# EAGLE design Grove - NunChuck v1.0 (EAGLE 6.3)
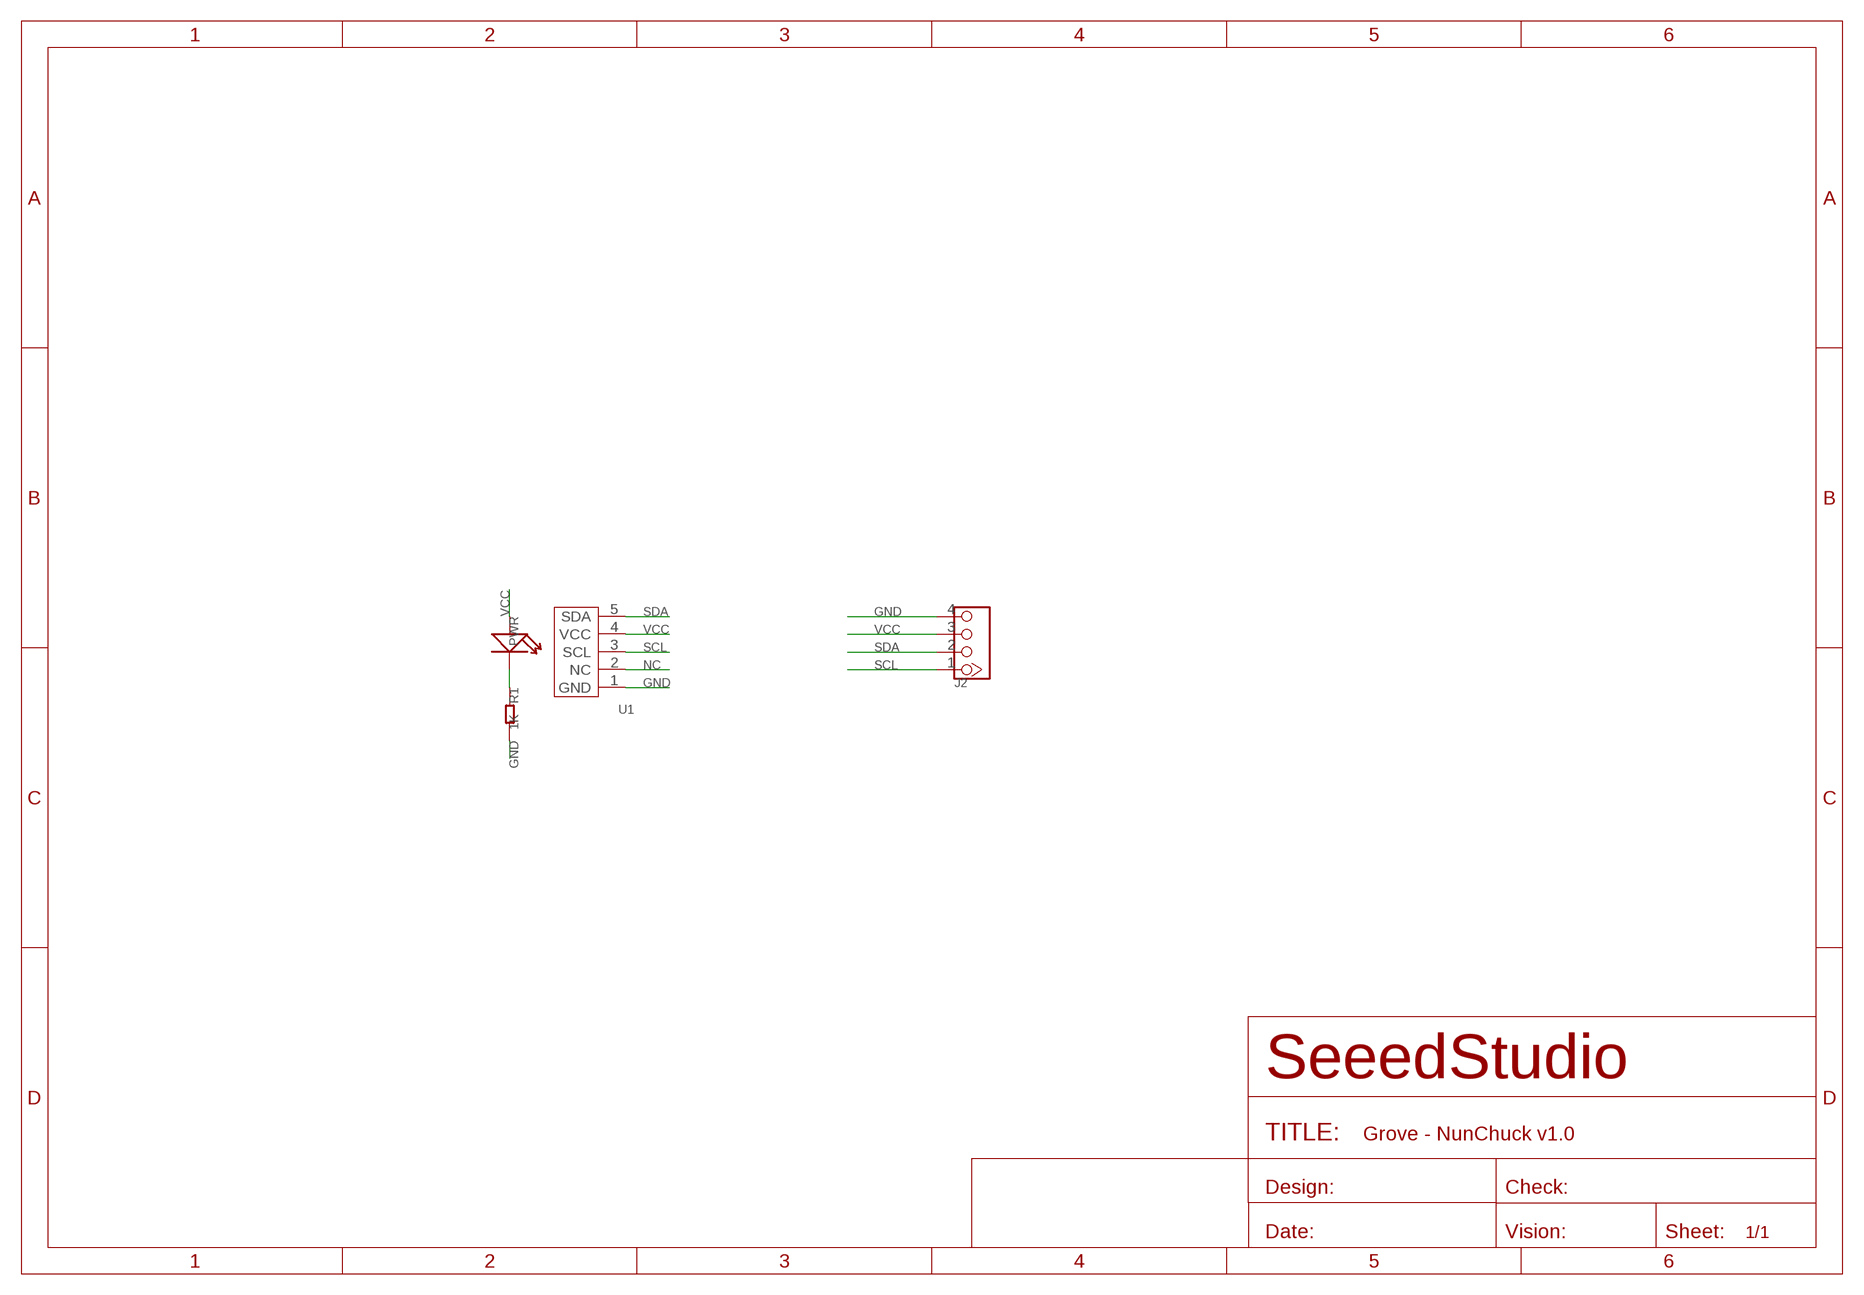
[diagram p0: schematic, sheet 1]

## Parts
J2  TWIG-4P-2.0-2.0  [4P-2.0]
PWR  LED'0603'  [LED-0603]
R1  1K  R-0603  [R0603]
U1  WIICHUCK  [WIICHUCK]

## Nets
GND: J2.4 R1.2 U1.1(GND)
N$1: PWR.- R1.1
NC: U1.2(NC)
SCL: J2.1 U1.3(SCL)
SDA: J2.2 U1.5(SDA)
VCC: J2.3 PWR.+ U1.4(VCC)

## Library data of the parts
J2 = Connector:TWIG-4P-2.0
PWR = Discrete:LED*
R1 = Discrete:R*
U1 = template:WIICHUCK

## Net classes
0 default: width 0.203 mm, drill 0.305 mm, clearance 0.152 mm

## Board
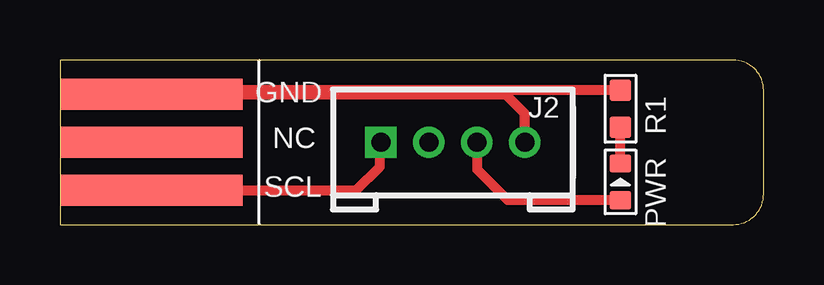
[diagram p1: board, top side]
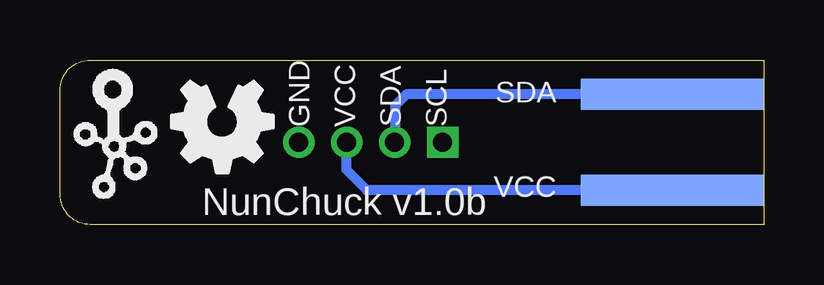
[diagram p2: board, bottom side, seen from below]

Size 29.34 x 6.86 mm. Coordinates in mm from the lower left corner, seen from the top.
Outline: 0,6.86 0,0 28.07,0 arc90 29.34,1.27 29.34,5.59 arc90 28.07,6.86 0,6.86
Copper layers (1*16): Top 0.035mm / dielectric 1.5mm / Bottom 0.035mm
Design rules "SeeedStudio_rule_no_angle_090911 *": minimum track width 6mil, minimum drill 12mil, track to track 6mil, track to pad 6mil, pad to pad 6mil, via to via 6mil, smd to smd 0mil, copper to edge 10mil, drill to drill 10mil, minimum pad ring 10mil, minimum via ring 6mil, stop-mask expansion 2mil, vias tented up to drill 25mil, thermal gap 10mil

### Footprints (pad centres in the part's own frame; a part is rotated, then mirrored left to right if it is on the bottom)
4P-2.0 = drill 0.8 pad 1.27 square: 1 -3,0 | drill 0.8 pad 1.27: 2 -1,0; 3 1,0; 4 3,0
LED-0603 = smd 0.762 x 0.889: + -0.762,0; - 0.762,0
R0603 = smd 0.889 x 0.889: 1 -0.762,0; 2 0.762,0
WIICHUCK = smd 7.6 x 1.3: 1 0,2; 2 0,0; 3 0,-2 | smd 7.6 x 1.3 bottom: 4 0,-2; 5 0,2

### Placement (x,y rotation side)
J2  16.38,3.43 0 top
PWR  23.37,1.78 90 top
R1  23.37,4.83 90 top
U1  3.81,3.43 0 top
U$5  [TWIGLOGO_SMALL]  24.89,6.6 180 bottom
U$6  [OSHW_FILLX150_NOTEXT]  20.45,5.97 180 bottom

### Tracks (layer width: path | path; a pad name or v marks a point on that pad's centre or on a via)
GND
  Top 0.406: U1.1 7.11,5.43 | 7.11,5.43 18.57,5.43 19.37,4.63 19.37,3.44 J2.4 | R1.2 7.27,5.59 7.11,5.43
N$1
  Top 0.406: PWR.- R1.1
SCL
  Top 0.406: U1.3 12.35,1.43 13.33,2.41 13.33,3.38 J2.1
SDA
  Bottom 0.406: U1.5 14.89,5.43 15.37,4.95 15.37,3.44 J2.2
VCC
  Top 0.406: PWR.+ 18.67,1.02 17.4,2.29 17.4,3.41 J2.3
  Bottom 0.406: U1.4 16.54,1.43 17.4,2.29 17.4,3.41 J2.3

### Text on the board
tPlace: GND | NC | SCL
bPlace: SDA | SCL | SDA | VCC | GND | VCC | NunChuck v1.0b